# Altium schematic sheet Sheet.SchDoc
size A3
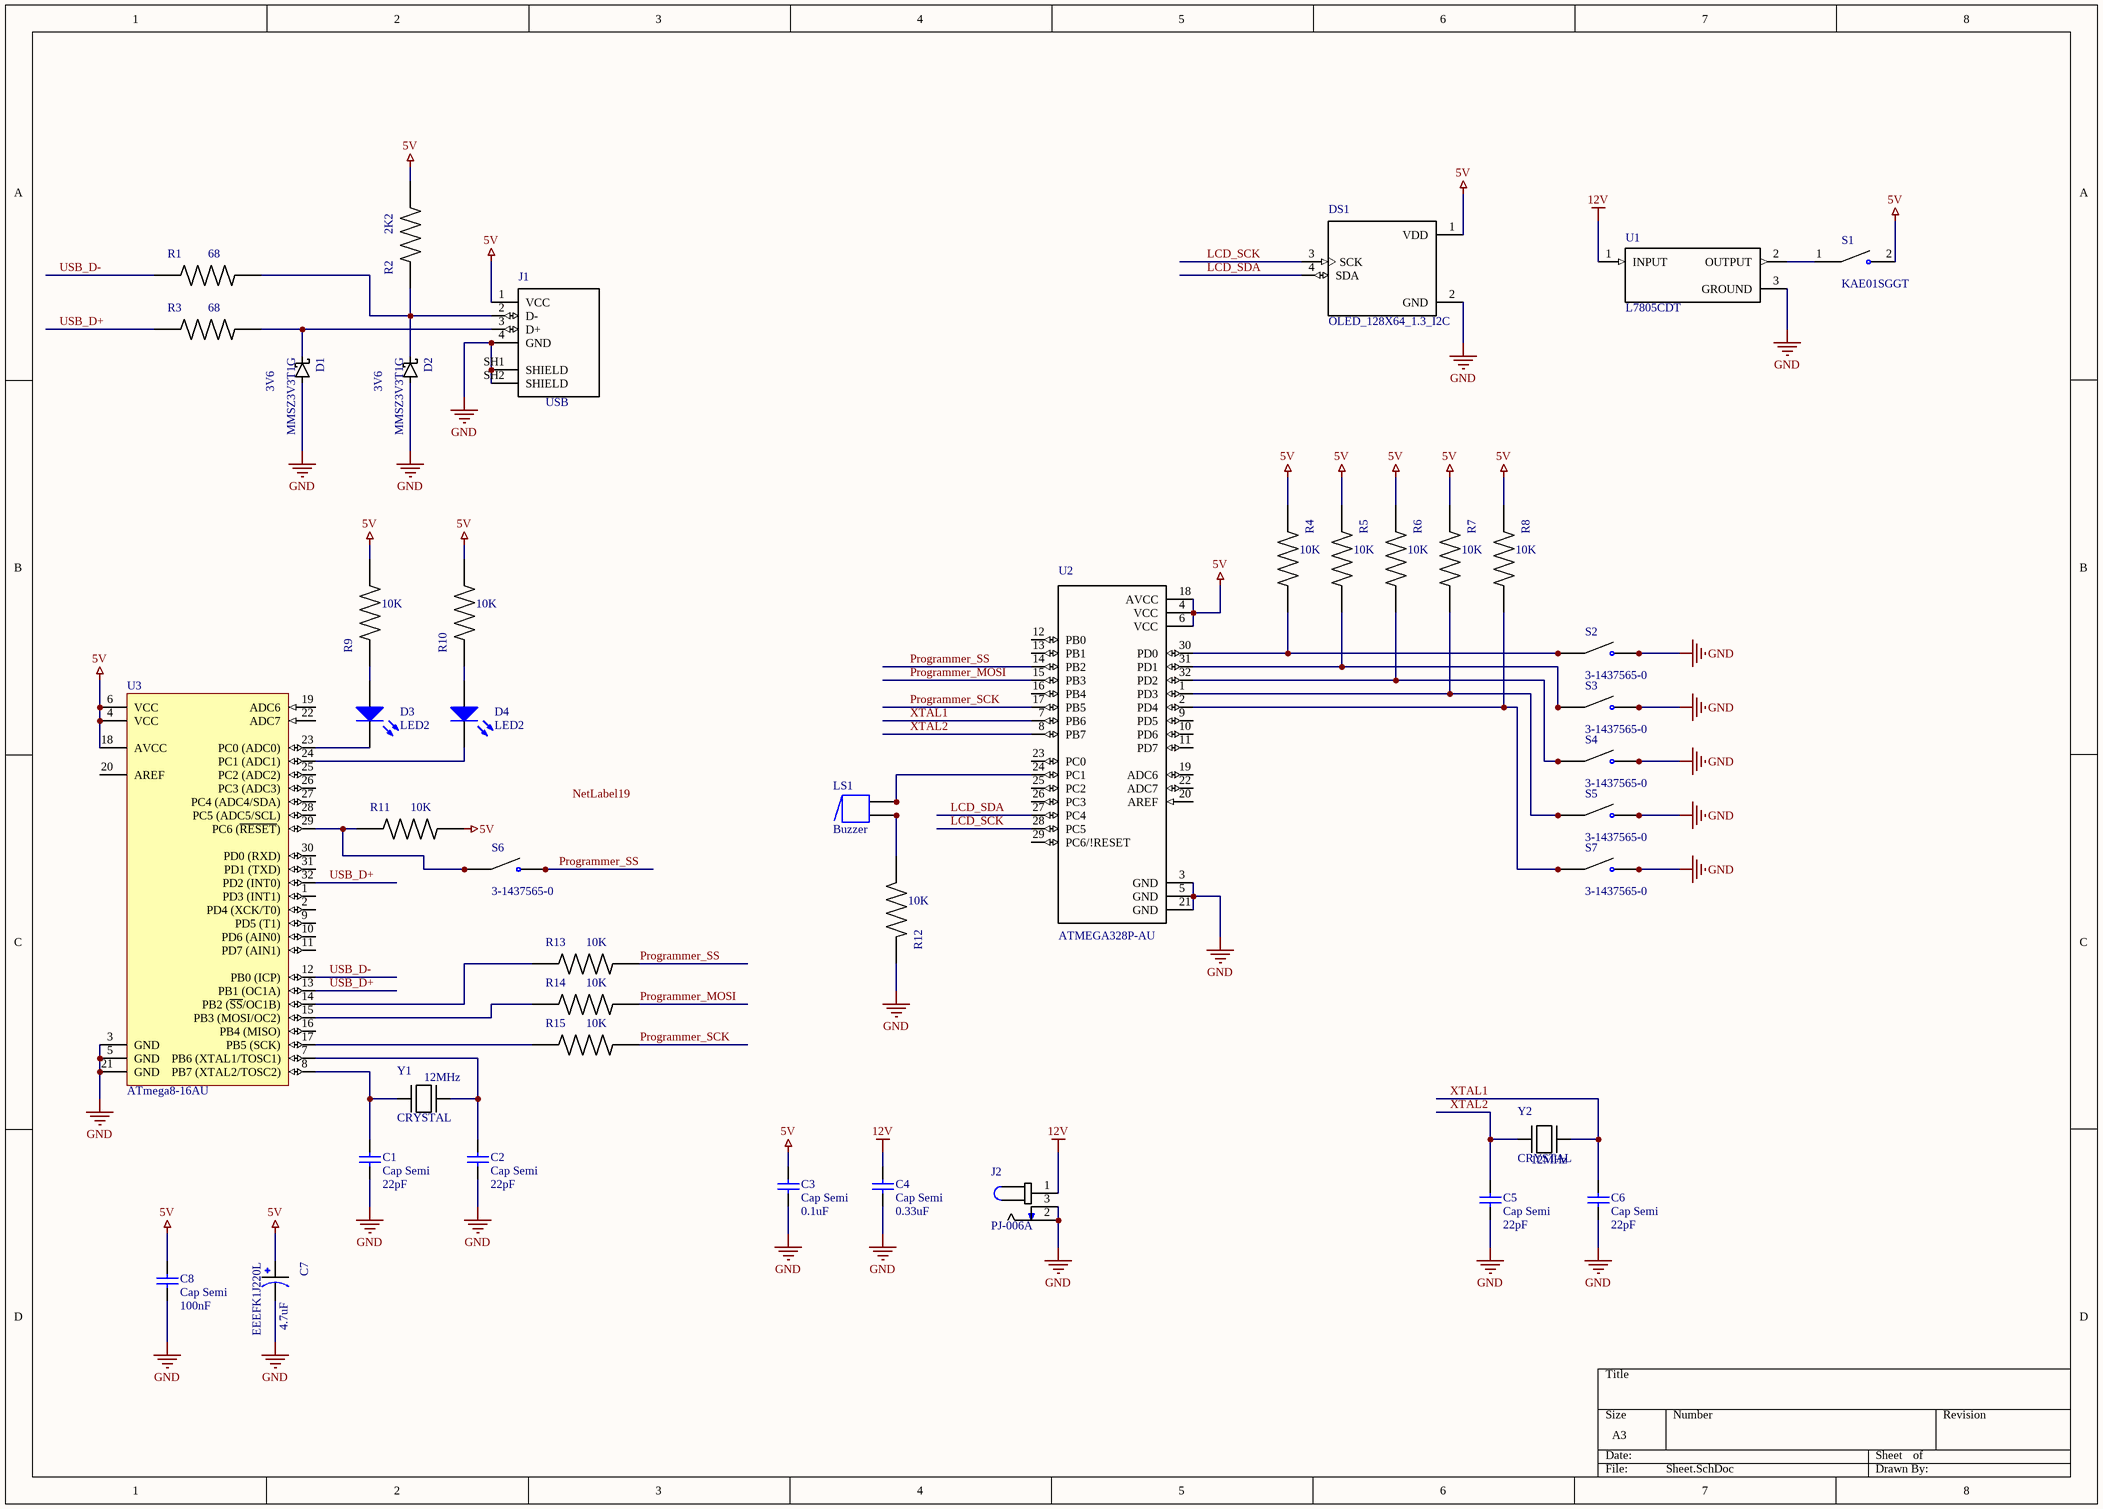
[diagram p0: Sheet.SchDoc]

## Parts
C1  Cap Semi  value 22pF  [C1206]
C2  Cap Semi  value 22pF  [C1206]
C3  Cap Semi  value 0.1uF  [C1206]
C4  Cap Semi  value 0.33uF  [C1206]
C5  Cap Semi  value 22pF  [C1206]
C6  Cap Semi  value 22pF  [C1206]
C7  EEEFK1J220L  value 4.7uF  [*CAP_EEEFK1J220L]
C8  Cap Semi  value 100nF  [C1206]
D1  MMSZ3V3T1G  value 3V6  [*MMSZ5V6T1G_MMSZ3V3T1G(Primary)]
D2  MMSZ3V3T1G  value 3V6  [*MMSZ5V6T1G_MMSZ3V3T1G(Primary)]
D3  LED2  [3.2X1.6X1.1]
D4  LED2  [3.2X1.6X1.1]
DS1  OLED_128X64_1.3_I2C  [*LCD_OLED_128X64_1.3_I2C]
J1  USB  [*GCT_USB1046-GF-0190-L-B-A_REVB4_USB1046-GF-0190-L-B-A_REVB4(Primary)]
J2  PJ-006A  [*CUI_PJ-006A]
LS1  Buzzer  [ABSM-1574]
R1  value 68  [*RESC3115X65N]  (hidden comment: 1-2176343-4)
R2  value 2K2  [*RESC3115X65N]  (hidden comment: 1-2176343-4)
R3  value 68  [*RESC3115X65N]  (hidden comment: 1-2176343-4)
R4  value 10K  [*RESC3115X65N]  (hidden comment: 1-2176343-4)
R5  value 10K  [*RESC3115X65N]  (hidden comment: 1-2176343-4)
R6  value 10K  [*RESC3115X65N]  (hidden comment: 1-2176343-4)
R7  value 10K  [*RESC3115X65N]  (hidden comment: 1-2176343-4)
R8  value 10K  [*RESC3115X65N]  (hidden comment: 1-2176343-4)
R9  value 10K  [*RESC3115X65N]  (hidden comment: 1-2176343-4)
R10  value 10K  [*RESC3115X65N]  (hidden comment: 1-2176343-4)
R11  value 10K  [*RESC3115X65N]  (hidden comment: 1-2176343-4)
R12  value 10K  [*RESC3115X65N]  (hidden comment: 1-2176343-4)
R13  value 10K  [*RESC3115X65N]  (hidden comment: 1-2176343-4)
R14  value 10K  [*RESC3115X65N]  (hidden comment: 1-2176343-4)
R15  value 10K  [*RESC3115X65N]  (hidden comment: 1-2176343-4)
S1  KAE01SGGT  [*SW_KAE01SGGT]
S2  3-1437565-0  [*SW_3-1437565-0]
S3  3-1437565-0  [*SW_3-1437565-0]
S4  3-1437565-0  [*SW_3-1437565-0]
S5  3-1437565-0  [*SW_3-1437565-0]
S6  3-1437565-0  [*SW_3-1437565-0]
S7  3-1437565-0  [*SW_3-1437565-0]
U1  L7805CDT  [*VREG_L7805CDT]
U2  ATMEGA328P-AU  [*QFP80P900X900X120-32N]
U3  ATmega8-16AU  [32A_M]
Y1  CRYSTAL  value 12MHz  [*XTAL_CAA-12.000-20-3050-X-R]
Y2  CRYSTAL  value 12MHz  [*XTAL_CAA-12.000-20-3050-X-R]

## Nets
5V: C3.2 C7.1 C8.2 DS1.1(VDD) J1.1(VCC) R2.2 R4.1 R5.1 R6.1 R7.1 R8.1 R9.2 R10.2 R11.2 S1.2 U2.4(VCC) U2.6(VCC) U2.18(AVCC) U3.4(VCC) U3.6(VCC) U3.18(AVCC)
12V: C4.2 J2.1 U1.1(INPUT)
GND: C1.1 C2.1 C3.1 C4.1 C5.1 C6.1 C7.2 C8.1 D1.A D2.A DS1.2(GND) J1.4(GND) J1.SH1(SHIELD) J1.SH2(SHIELD) J2.2 J2.3 R12.1 S2.3(NO) S2.4(NO) S3.3(NO) S3.4(NO) S4.3(NO) S4.4(NO) S5.3(NO) S5.4(NO) S7.3(NO) S7.4(NO) U1.3(GROUND) U2.3(GND) U2.5(GND) U2.21(GND) U3.3(GND) U3.5(GND) U3.21(GND)
LCD_SCK: DS1.3(SCK) U2.28(PC5)
LCD_SDA: DS1.4(SDA) U2.27(PC4)
Programmer_MOSI: R14.2 U2.15(PB3)
Programmer_SCK: R15.2 U2.17(PB5)
Programmer_SS: R13.2 S6.3(NO) S6.4(NO) U2.14(PB2)
USB_D+: R3.1 U3.13(PB1_(OC1A)) U3.32(PD2_(INT0))
USB_D-: R1.1 U3.12(PB0_(ICP))
XTAL1: C6.2 U2.7(PB6) Y2.2
XTAL2: C5.2 U2.8(PB7) Y2.1
NetC1_2: C1.2 U3.8(PB7_(XTAL2/TOSC2)) Y1.1
NetC2_2: C2.2 U3.7(PB6_(XTAL1/TOSC1)) Y1.2
NetD1_K: D1.K J1.3(D+) R3.2
NetD2_K: D2.K J1.2(D-) R1.2 R2.1
NetD3_1: D3.1(A) R9.1
NetD3_2: D3.2(K) U3.23(PC0_(ADC0))
NetD4_1: D4.1(A) R10.1
NetD4_2: D4.2(K) U3.24(PC1_(ADC1))
NetLS1_1: LS1.1 LS1.1A U2.24(PC1)
NetLS1_2: LS1.2 LS1.2A R12.2
NetR4_2: R4.2 S2.1(COM) S2.2(COM) U2.30(PD0)
NetR5_2: R5.2 S3.1(COM) S3.2(COM) U2.31(PD1)
NetR6_2: R6.2 S4.1(COM) S4.2(COM) U2.32(PD2)
NetR7_2: R7.2 S5.1(COM) S5.2(COM) U2.1(PD3)
NetR8_2: R8.2 S7.1(COM) S7.2(COM) U2.2(PD4)
NetR11_1: R11.1 S6.1(COM) S6.2(COM) U3.29(PC6_(~{RESET}))
NetR13_1: R13.1 U3.14(PB2_(~{SS}/OC1B))
NetR14_1: R14.1 U3.15(PB3_(MOSI/OC2))
NetR15_1: R15.1 U3.17(PB5_(SCK))
NetS1_1: S1.1 U1.2(OUTPUT)

Not connected (* = marked no-connect by the designer): U2 9(PD5) 10(PD6) 11(PD7) 12(PB0) 13(PB1) 16(PB4) 19(ADC6) 20(AREF) 22(ADC7) 23(PC0) 25(PC2) 26(PC3) 29(PC6/!RESET); U3 1(PD3_(INT1)) 2(PD4_(XCK/T0)) 9(PD5_(T1)) 10(PD6_(AIN0)) 11(PD7_(AIN1)) 16(PB4_(MISO)) 19(ADC6) 20(AREF) 22(ADC7) 25(PC2_(ADC2)) 26(PC3_(ADC3)) 27(PC4_(ADC4/SDA)) 28(PC5_(ADC5/SCL)) 30(PD0_(RXD)) 31(PD1_(TXD))

## Notes on the sheet
- Labels drawn without touching a wire or pin: NetLabel19

## Library data of the parts
C1-C6 C8 = Cap Semi: Capacitor (Semiconductor SIM Model); Published: 8-Jun-2000; LatestRevisionDate: 29-May-2009; LatestRevisionNote: IPC-7351 Footprint Added.; PackageReference: C1206; Publisher: Altium Limited; PackageDescription: Chip Capacitor
C7 = EEEFK1J220L: CAP ALUM 22UF 20% 63V SMD; MF: Panasonic; Package: RADIAL-2 Panasonic; Price: None; SnapEDA_Link: https://www.snapeda.com/parts/EEEFK1J220L/Panasonic/view-part/?ref=snap; MP: EEEFK1J220L; Availability: In Stock; Check_prices: https://www.snapeda.com/parts/EEEFK1J220L/Panasonic/view-part/?ref=eda
D1 D2 = MMSZ3V3T1G: Zener Diode 3.3 V 500 mW Â±5% Surface Mount SOD-123; MF: ON Semiconductor; Package: SOD-123-2 ON Semiconductor; Price: None; SnapEDA_Link: https://www.snapeda.com/parts/MMSZ3V3T1G/Onsemi/view-part/?ref=snap; MP: MMSZ3V3T1G; Availability: In Stock; Check_prices: https://www.snapeda.com/parts/MMSZ3V3T1G/Onsemi/view-part/?ref=eda
D3 D4 = LED2: Typical RED, GREEN, YELLOW, AMBER GaAs LED; Published: 8-Jun-2000; LatestRevisionDate: 17-Jul-2002; LatestRevisionNote: Re-released for DXP Platform.; PackageVersion: Feb-2002; PackageReference: 3.2X1.6X1.1; Publisher: Altium Limited; PackageDescription: SM LED; 2 Flat Leads
DS1 = OLED_128X64_1.3_I2C: Non-Touch Graphic LCD Display Module Transmissive White OLED, Monochrome I2C 1.3 (33.02mm) 128 x 64; MF: UNIVERSAL-SOLDER Electronics Ltd; MP: OLED 128x64 1.3&quot; I2C; Package: None; Price: None; SnapEDA_Link: https://www.snapeda.com/parts/OLED%20128x64%201.3%22%20I2C/UNIVERSAL-SOLDER+Electronics+Ltd/view-part/?ref=snap; Availability: Not in stock; Check_prices: https://www.snapeda.com/parts/OLED%20128x64%201.3%22%20I2C/UNIVERSAL-SOLDER+Electronics+Ltd/view-part/?ref=eda; Value: *
J1 = USB1046-GF-0190-L-B-A_REVB4: USB-A (USB TYPE-A) USB 2.0 Receptacle Connector 4 Position Surface Mount, Through Hole; MF: Global Connector Technology; Package: None; Price: None; SnapEDA_Link: https://www.snapeda.com/parts/USB1046-GF-0190-L-B-A/Global+Connector+Technology/view-part/?ref=snap; MP: USB1046-GF-0190-L-B-A; Availability: In Stock; Check_prices: https://www.snapeda.com/parts/USB1046-GF-0190-L-B-A/Global+Connector+Technology/view-part/?ref=eda; Value: *
J2 = PJ-006A: 2.0 x 6.3 mm, 2.0 A, Vertical, Through Hole, Dc Power Jack Connector; MF: Same Sky; Package: None; Price: None; SnapEDA_Link: https://www.snapeda.com/parts/PJ-006A/Same+Sky/view-part/?ref=snap; MP: PJ-006A; Availability: In Stock; Check_prices: https://www.snapeda.com/parts/PJ-006A/Same+Sky/view-part/?ref=eda; Value: *
LS1 = Buzzer: Magnetic Transducer Buzzer; Published: 24-Mar-1999; LatestRevisionDate: 17-Dec-2003; LatestRevisionNote: Schematic revised, PCB Footprint replaced.; DatasheetVersion: 17-Dec-2003; PackageReference: ABSM-1574; Publisher: Altium Limited; PackageDescription: Magnetic Transducer Buzzer; ComponentLink1Description: Manufacturer Link; ComponentLink1URL: http://www.megastar.com/linecard/buzzmode/index.php
R1-R15 = CRGCQ1206F120R: Fixed Resistor CRGCQ 1206 120R 1%; MF: TE Connectivity; Package: 3115 TE Connectivity; Price: None; SnapEDA_Link: https://www.snapeda.com/parts/CRGCQ1206F120R/TE+Connectivity/view-part/?ref=snap; MP: CRGCQ1206F120R; Availability: In Stock; Check_prices: https://www.snapeda.com/parts/CRGCQ1206F120R/TE+Connectivity/view-part/?ref=eda
S1 = KAE01SGGT: Dip Switch SPST 1 Position Surface Mount Slide (Standard) Actuator 25mA 24VDC; MF: E-Switch; Package: None; Price: None; SnapEDA_Link: https://www.snapeda.com/parts/KAE01SGGT/E-Switch/view-part/?ref=snap; MP: KAE01SGGT; Availability: In Stock; Check_prices: https://www.snapeda.com/parts/KAE01SGGT/E-Switch/view-part/?ref=eda; Value: *
S2-S7 = 3-1437565-0: Switch Tactile OFF (ON) SPST Round Button Gull Wing 0.05A 24VDC 1VA 9.18N SMD T/R; MF: TE Connectivity; MP: 314375650; Package: None; Price: None; SnapEDA_Link: https://www.snapeda.com/parts/314375650/TE+Connectivity/view-part/?ref=snap; Availability: In Stock; Check_prices: https://www.snapeda.com/parts/314375650/TE+Connectivity/view-part/?ref=eda; Value: *
U1 = L7805CDT: Linear Voltage Regulator IC Positive Fixed 1 Output  1.5A DPAK; MF: STMicroelectronics; Package: TO-252-3 STMicroelectronics; Price: None; SnapEDA_Link: https://www.snapeda.com/parts/L7805CDT/STMicroelectronics/view-part/?ref=snap; MP: L7805CDT; Availability: In Stock; Check_prices: https://www.snapeda.com/parts/L7805CDT/STMicroelectronics/view-part/?ref=eda; Value: *
U2 = ATMEGA328P-AU: MCU 8-bit - AVR ATmega Family ATmega328 Series Microcontrollers - 20 MHz - 32 KB - 2 KB - 32 Pins.; MF: MICROCHIP TECH.; DigiKey_Part_Number: ATMEGA328P-AU-ND; SnapEDA_Link: https://www.snapeda.com/parts/ATMEGA328P-AU/Microchip+Technology/view-part/?ref=snap; Package: TQFP-32 Microchip; MP: ATMEGA328P-AU; Check_prices: https://www.snapeda.com/parts/ATMEGA328P-AU/Microchip+Technology/view-part/?ref=eda; Value: *
U3 = ATmega8-16AU: 8-bit AVR Microcontroller, 4.5-5.5V, 16MHz, 8KB Flash, 512 Bytes EEPROM, 1KB SRAM, 32-pin TQFP, Industrial Grade (-40°C to 85°C); DatasheetVersion: revZ, Feb-2011; PackageVersion: revC, Oct-2010; PackageReference: 32A; PackageDescription: 32-Lead, 7x7x1.0 mm Body, 0.8mm Lead Pitch, Thin Profile Plastic Quad Flat Package (TQFP); Code_JEDEC: MS-026-ABA; ComponentLink1Description: Manufacturer URL; ComponentLink1URL: http://www.atmel.com/; ComponentLink2Description: ATmega8(L); ComponentLink2URL: http://www.atmel.com/dyn/resources/prod_documents/doc2486.pdf; ComponentLink3Description: ATmega8(L) Summary; ComponentLink3URL: http://www.atmel.com/dyn/resources/prod_documents/2486S.pdf
Y1 Y2 = CAA-12.000-20-3050-X-R: 12 MHz Â±30ppm Crystal 20pF 50 Ohms HC-49/US; MF: Aker Technology Corp; Package: SMD-4 AKER; Price: None; SnapEDA_Link: https://www.snapeda.com/parts/CAA-12.000-20-3050-X-R/Aker/view-part/?ref=snap; MP: CAA-12.000-20-3050-X-R; Availability: In Stock; Check_prices: https://www.snapeda.com/parts/CAA-12.000-20-3050-X-R/Aker/view-part/?ref=eda